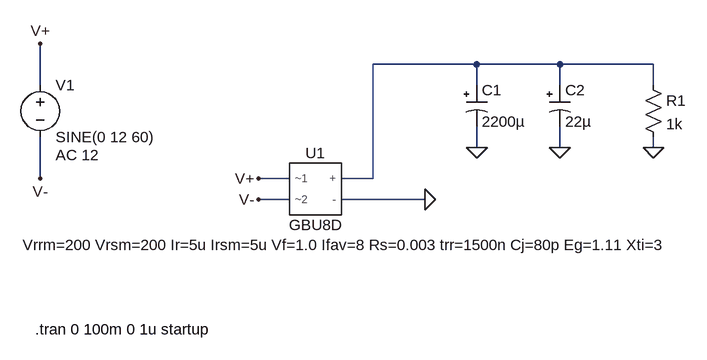
[diagram p0: schematic Draft10.asc]
Draft10.asc, the LTspice schematic file:
Version 4
SHEET 1 1152 680
WIRE 784 64 624 64
WIRE 912 64 784 64
WIRE 1056 64 912 64
WIRE 112 96 112 32
WIRE 784 96 784 64
WIRE 912 96 912 64
WIRE 1056 96 1056 64
WIRE 784 192 784 160
WIRE 912 192 912 160
WIRE 1056 192 1056 176
WIRE 112 240 112 176
WIRE 496 240 448 240
WIRE 624 240 624 64
WIRE 624 240 576 240
WIRE 496 272 448 272
WIRE 704 272 576 272
FLAG 112 32 V+
FLAG 112 240 V-
FLAG 448 240 V+
FLAG 448 272 V-
FLAG 704 272 0
FLAG 784 192 0
FLAG 912 192 0
FLAG 1056 192 0
SYMBOL voltage 112 80 R0
WINDOW 123 24 124 Left 2
WINDOW 39 0 0 Left 0
SYMATTR InstName V1
SYMATTR Value SINE(0 12 60)
SYMATTR Value2 AC 12
SYMBOL gbu8d 528 256 R0
SYMATTR InstName U1
SYMBOL polcap 768 96 R0
SYMATTR InstName C1
SYMATTR Value 2200µ
SYMBOL polcap 896 96 R0
SYMATTR InstName C2
SYMATTR Value 22µ
SYMBOL res 1040 80 R0
SYMATTR InstName R1
SYMATTR Value 1k
TEXT 104 472 Left 2 !.tran 0 100m 0 1u startup

The netlist it stands for:
* Draft10.asc
V1 V+ V- SINE(0 12 60) AC 12
XU1 V+ V- N001 0 GBU8D Vrrm=200 Vrsm=200 Ir=5u Irsm=5u Vf=1.0 Ifav=8 Rs=0.003 trr=1500n Cj=80p Eg=1.11 Xti=3  ; pins ~1 ~2 + -
C1 N001 0 2200µ
C2 N001 0 22µ
R1 N001 0 1k
.tran 0 100m 0 1u startup
.lib .\gbu8d_spice.lib
.backanno
.end